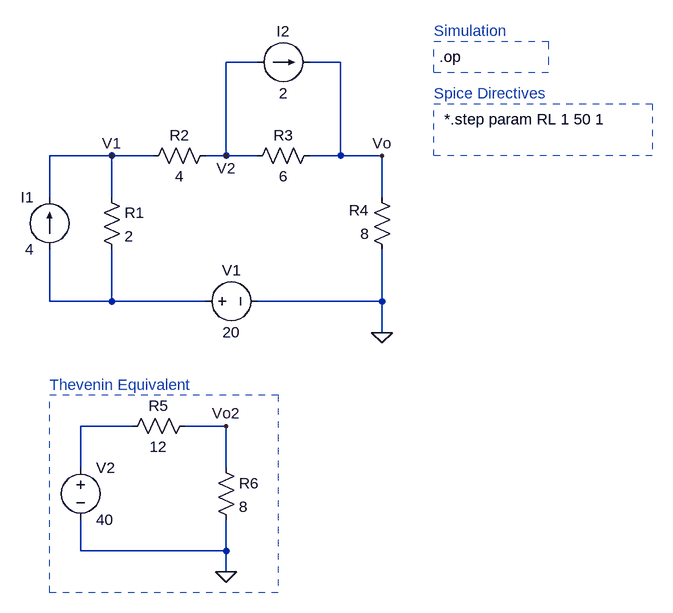
[diagram p0: schematic Example_2_MaxTransfer.asc]
Example_2_MaxTransfer.asc, the LTspice schematic file:
Version 4
SHEET 1 1432 916
WIRE 368 96 320 96
WIRE 496 96 448 96
WIRE 144 240 48 240
WIRE 208 240 144 240
WIRE 320 240 320 96
WIRE 320 240 288 240
WIRE 368 240 320 240
WIRE 496 240 496 96
WIRE 496 240 448 240
WIRE 560 240 496 240
WIRE 48 304 48 240
WIRE 144 304 144 240
WIRE 560 304 560 240
WIRE 48 464 48 384
WIRE 144 464 144 384
WIRE 144 464 48 464
WIRE 288 464 144 464
WIRE 560 464 560 384
WIRE 560 464 368 464
WIRE 560 512 560 464
WIRE 176 656 96 656
WIRE 320 656 256 656
WIRE 96 720 96 656
WIRE 320 720 320 656
WIRE 96 848 96 800
WIRE 320 848 320 800
WIRE 320 848 96 848
WIRE 320 880 320 848
FLAG 560 512 0
FLAG 560 240 Vo
FLAG 144 240 V1
FLAG 320 240 V2
FLAG 320 880 0
FLAG 320 656 Vo2
SYMBOL current 48 384 R180
WINDOW 0 24 80 Left 2
WINDOW 3 24 0 Left 2
SYMATTR InstName I1
SYMATTR Value 4
SYMBOL current 368 96 R270
WINDOW 0 32 40 VTop 2
WINDOW 3 -32 40 VBottom 2
SYMATTR InstName I2
SYMATTR Value 2
SYMBOL voltage 272 464 R270
WINDOW 0 32 56 VTop 2
WINDOW 3 -32 56 VBottom 2
SYMATTR InstName V1
SYMATTR Value 20
SYMBOL res 128 288 R0
SYMATTR InstName R1
SYMATTR Value 2
SYMBOL res 304 224 R90
WINDOW 0 0 56 VBottom 2
WINDOW 3 32 56 VTop 2
SYMATTR InstName R2
SYMATTR Value 4
SYMBOL res 464 224 R90
WINDOW 0 0 56 VBottom 2
WINDOW 3 32 56 VTop 2
SYMATTR InstName R3
SYMATTR Value 6
SYMBOL res 576 400 R180
WINDOW 0 36 76 Left 2
WINDOW 3 36 40 Left 2
SYMATTR InstName R4
SYMATTR Value 8
SYMBOL voltage 96 704 R0
SYMATTR InstName V2
SYMATTR Value 40
SYMBOL res 272 640 R90
WINDOW 0 0 56 VBottom 2
WINDOW 3 32 56 VTop 2
SYMATTR InstName R5
SYMATTR Value 12
SYMBOL res 304 704 R0
SYMATTR InstName R6
SYMATTR Value 8
TEXT 640 48 Left 2 ;Simulation
TEXT 648 88 Left 2 !.op
TEXT 656 184 Left 2 !*.step param RL 1 50 1
TEXT 640 144 Left 2 ;Spice Directives
TEXT 48 592 Left 2 ;Thevenin Equivalent
RECTANGLE Normal 816 112 640 64 2
RECTANGLE Normal 976 240 640 160 2
RECTANGLE Normal 400 912 48 608 2

The netlist it stands for:
* Example_2_MaxTransfer.asc
I1 N001 V1 4
I2 V2 Vo 2
V1 N001 0 20
R1 V1 N001 2
R2 V2 V1 4
R3 Vo V2 6
R4 0 Vo 8
V2 N002 0 40
R5 Vo2 N002 12
R6 Vo2 0 8
* Simulation
.op
*.step param RL 1 50 1
* Spice Directives
* Thevenin Equivalent
.backanno
.end